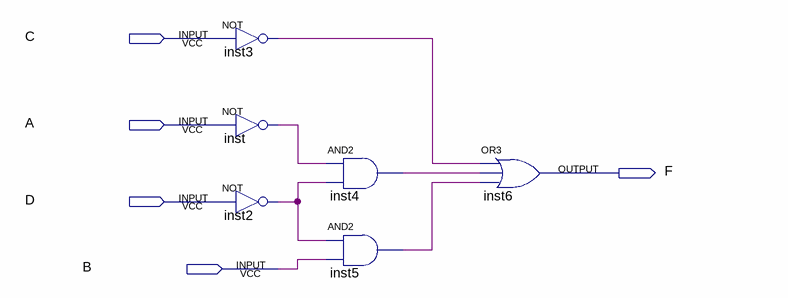
[diagram p0: schematic sheet]
// Quartus schematic s1113341_lab1.bdf as structural Verilog: 6 symbols, 5 pins
module s1113341_lab1 (
  input  C,
  input  A,
  input  D,
  input  B,
  output F
);

  wire inst2_out, inst3_out, inst4_out, inst5_out, inst_out;

  not inst3 (inst3_out, C);
  not inst (inst_out, A);
  not inst2 (inst2_out, D);
  and inst4 (inst4_out, inst_out, inst2_out);
  and inst5 (inst5_out, inst2_out, B);
  or inst6 (F, inst3_out, inst4_out, inst5_out);
endmodule
